# EAGLE design Pure Keys aec-pcb2-inProgress (EAGLE 8.7.0)

## Sheet 1 of 7: ATMEGA328P
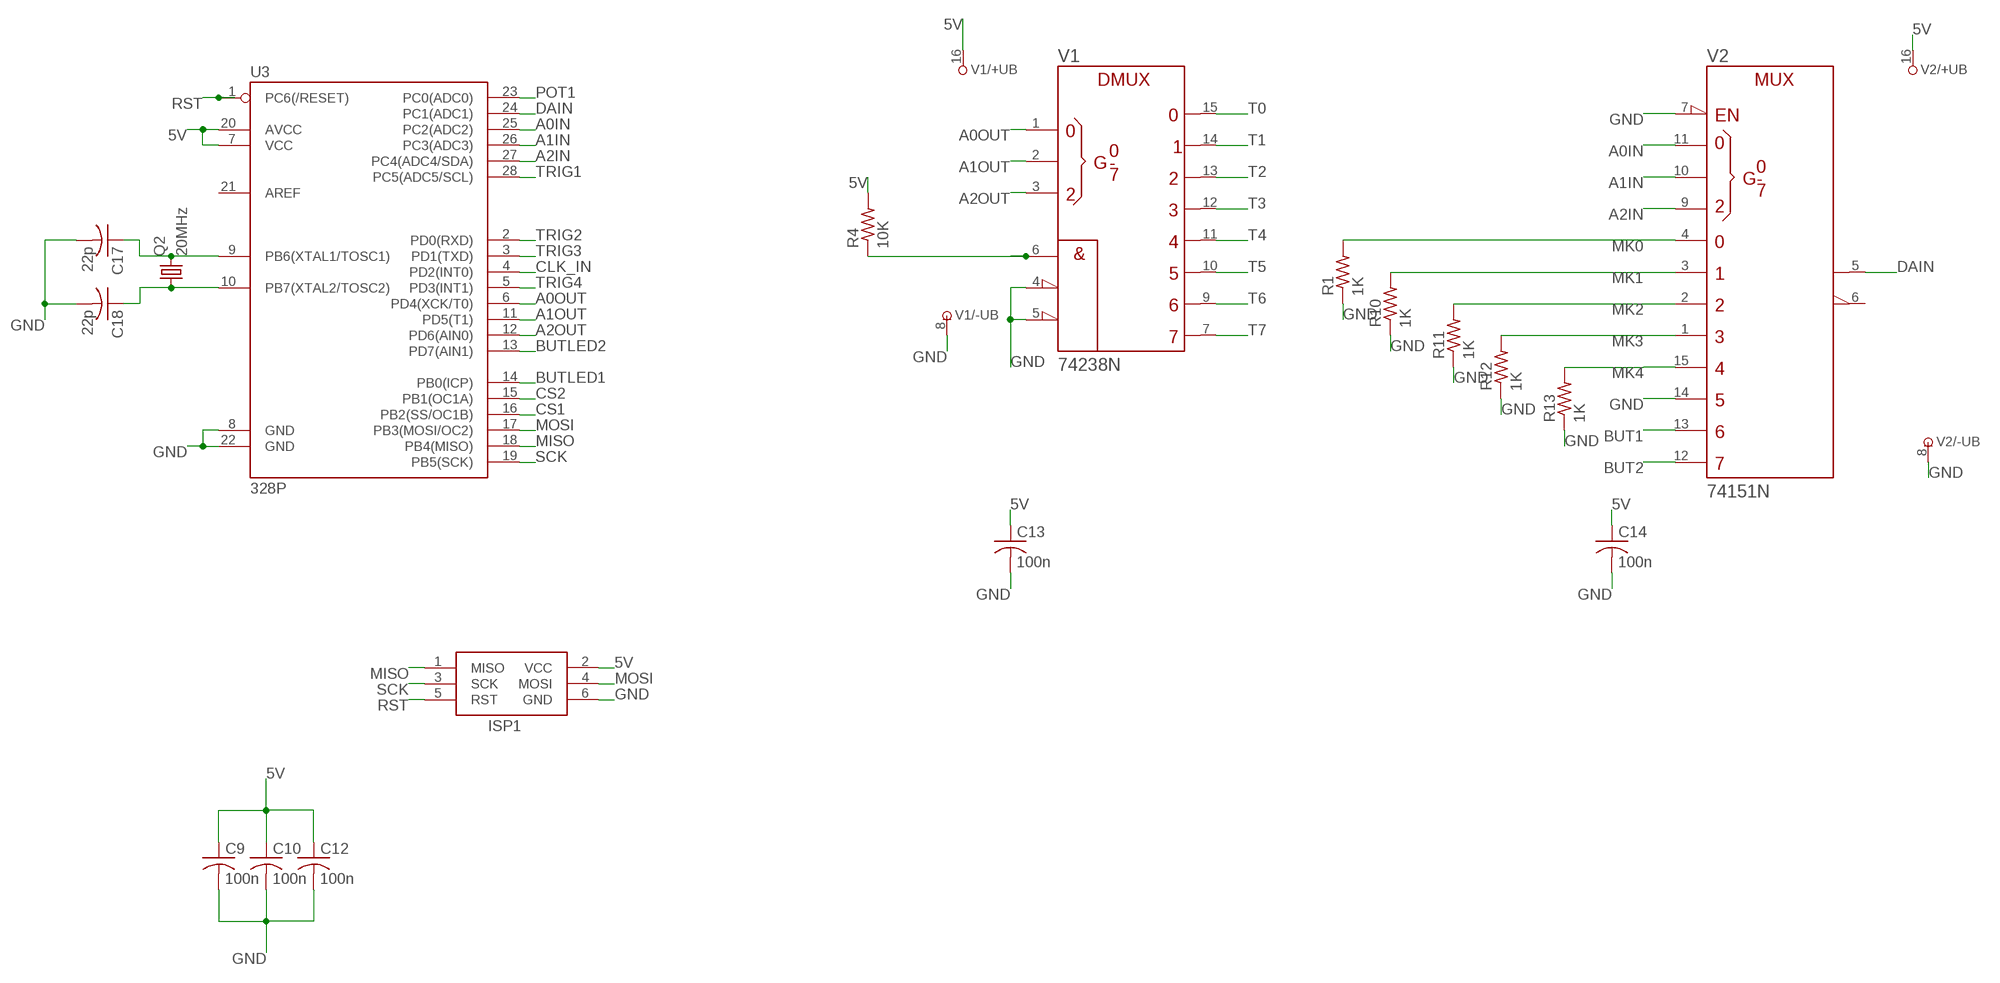
[diagram p0: schematic, sheet 1]

### Parts
C9  100n  C-USC0805K  [C0805K]
C10  100n  C-USC0805K  [C0805K]
C12  100n  C-USC0805K  [C0805K]
C13  100n  C-USC0805K  [C0805K]
C14  100n  C-USC0805K  [C0805K]
C17  22p  C-USC0805K  [C0805K]
C18  22p  C-USC0805K  [C0805K]
ISP1  AVRISP-6  [AVRISP]
Q2  20MHz  CRYSTALHC49UP  [HC49UP]
R1  1K  R-US_R0805  [R0805]
R4  10K  R-US_R0805  [R0805]
R10  1K  R-US_R0805  [R0805]
R11  1K  R-US_R0805  [R0805]
R12  1K  R-US_R0805  [R0805]
R13  1K  R-US_R0805  [R0805]
U3  328P  ATMEGA328P_PDIP  [DIP28]
V1  74238N  [DIL16]
V2  74151N  [DIL16]

### Nets
5V [Power]: C9.1 C10.1 C12.1 C13.1 C14.1 ISP1.2(VCC) R4.2 U3.7(VCC) U3.20(AVCC) V1.16(+UB) V2.16(+UB) ; also sheet 2,4,5,6,7
A0IN: U3.25(PC2(ADC2)) V2.11(A)
A0OUT: U3.6(PD4(XCK/T0)) V1.1(A)
A1IN: U3.26(PC3(ADC3)) V2.10(B)
A1OUT: U3.11(PD5(T1)) V1.2(B)
A2IN: U3.27(PC4(ADC4/SDA)) V2.9(C)
A2OUT: U3.12(PD6(AIN0)) V1.3(C)
BUT1: V2.13(D6) ; also sheet 6
BUT2: V2.12(D7) ; also sheet 6
BUTLED1: U3.14(PB0(ICP)) ; also sheet 6
BUTLED2: U3.13(PD7(AIN1)) ; also sheet 6
CLK_IN: U3.4(PD2(INT0)) ; also sheet 7
CS1: U3.16(PB2(SS/OC1B)) ; also sheet 5
CS2: U3.15(PB1(OC1A)) ; also sheet 5
DAIN: U3.24(PC1(ADC1)) V2.5(Y)
ENOUT: R4.1 V1.6(G1)
GND [Power]: C9.2 C10.2 C12.2 C13.2 C14.2 C17.2 C18.2 ISP1.6(GND) R1.1 R10.1 R11.1 R12.1 R13.1 U3.8(GND) U3.22(GND) V1.4(!G2A) V1.5(!G2B) V1.8(-UB) V2.7(!G) V2.8(-UB) V2.14(D5) ; also sheet 2,3,4,5,6,7
MISO: ISP1.1(MISO) U3.18(PB4(MISO))
MK0: R1.2 V2.4(D0) ; also sheet 3
MK1: R10.2 V2.3(D1) ; also sheet 3
MK2: R11.2 V2.2(D2) ; also sheet 3
MK3: R12.2 V2.1(D3) ; also sheet 3
MK4: R13.2 V2.15(D4) ; also sheet 3
MOSI: ISP1.4(MOSI) U3.17(PB3(MOSI/OC2)) ; also sheet 5
N$10: C17.1 Q2.2 U3.9(PB6(XTAL1/TOSC1))
N$11: C18.1 Q2.1 U3.10(PB7(XTAL2/TOSC2))
POT1: U3.23(PC0(ADC0)) ; also sheet 6
RST: ISP1.5(RST) U3.1(PC6(/RESET))
SCK: ISP1.3(SCK) U3.19(PB5(SCK)) ; also sheet 5
T0: V1.15(Y0) ; also sheet 3
T1: V1.14(Y1) ; also sheet 3
T2: V1.13(Y2) ; also sheet 3
T3: V1.12(Y3) ; also sheet 3
T4: V1.11(Y4) ; also sheet 3
T5: V1.10(Y5) ; also sheet 3
T6: V1.9(Y6) ; also sheet 3
T7: V1.7(Y7) ; also sheet 3
TRIG1: U3.28(PC5(ADC5/SCL)) ; also sheet 4
TRIG2: U3.2(PD0(RXD)) ; also sheet 4
TRIG3: U3.3(PD1(TXD)) ; also sheet 4
TRIG4: U3.5(PD3(INT1)) ; also sheet 4
Unconnected: U3.21(AREF) V2.6(W)

## Sheet 2 of 7: Power
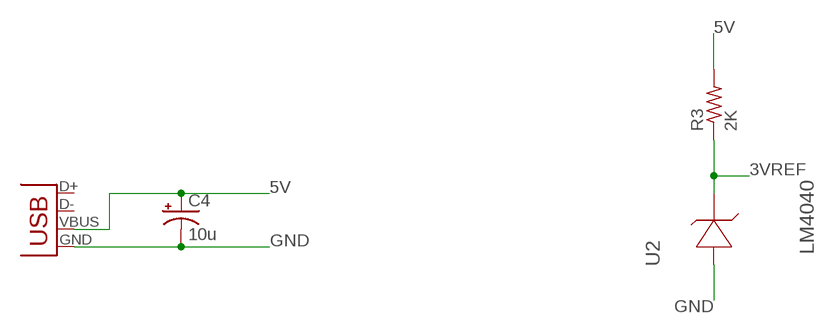
[diagram p1: schematic, sheet 2]

### Parts
C4  10u  CPOL-US153CLV-0505  [153CLV-0505]
JP2  USB-B  USBPTH  [USB-B-PTH]
R3  2K  R-US_R0805  [R0805]
U2  LM4040  LM4040A30IDBZT  [SOT95P237X112-3N]

### Nets
3VREF: R3.1 U2.1(CATHODE) ; also sheet 5
5V [Power]: C4.+ JP2.VBUS R3.2 ; also sheet 1,4,5,6,7
GND [Power]: C4.- JP2.GND U2.2(ANODE) ; also sheet 1,3,4,5,6,7
Unconnected: JP2.D+ JP2.D- U2.3(NC)

## Sheet 3 of 7: Keyboard Connector
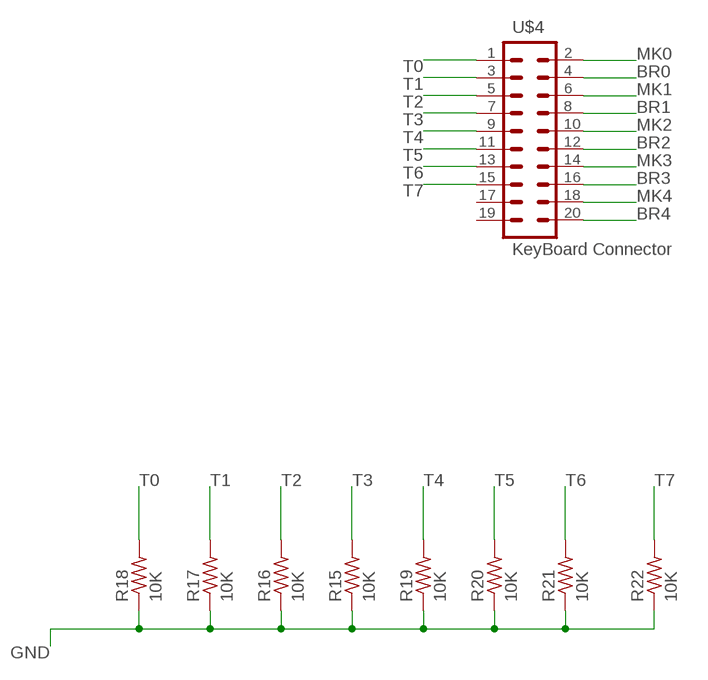
[diagram p2: schematic, sheet 3]

### Parts
R15  10K  R-US_R0805  [R0805]
R16  10K  R-US_R0805  [R0805]
R17  10K  R-US_R0805  [R0805]
R18  10K  R-US_R0805  [R0805]
R19  10K  R-US_R0805  [R0805]
R20  10K  R-US_R0805  [R0805]
R21  10K  R-US_R0805  [R0805]
R22  10K  R-US_R0805  [R0805]
U$4  KeyBoard Connector  M10X22X10_LOCK  [2X10_LOCK]

### Nets
BR0: U$4.4
BR1: U$4.8
BR2: U$4.12
BR3: U$4.16
BR4: U$4.20
GND [Power]: R15.1 R16.1 R17.1 R18.1 R19.1 R20.1 R21.1 R22.1 ; also sheet 1,2,4,5,6,7
MK0: U$4.2 ; also sheet 1
MK1: U$4.6 ; also sheet 1
MK2: U$4.10 ; also sheet 1
MK3: U$4.14 ; also sheet 1
MK4: U$4.18 ; also sheet 1
T0: R18.2 U$4.1 ; also sheet 1
T1: R17.2 U$4.3 ; also sheet 1
T2: R16.2 U$4.5 ; also sheet 1
T3: R15.2 U$4.7 ; also sheet 1
T4: R19.2 U$4.9 ; also sheet 1
T5: R20.2 U$4.11 ; also sheet 1
T6: R21.2 U$4.13 ; also sheet 1
T7: R22.2 U$4.15 ; also sheet 1
Unconnected: U$4.17 U$4.19

## Sheet 4 of 7: Triggers
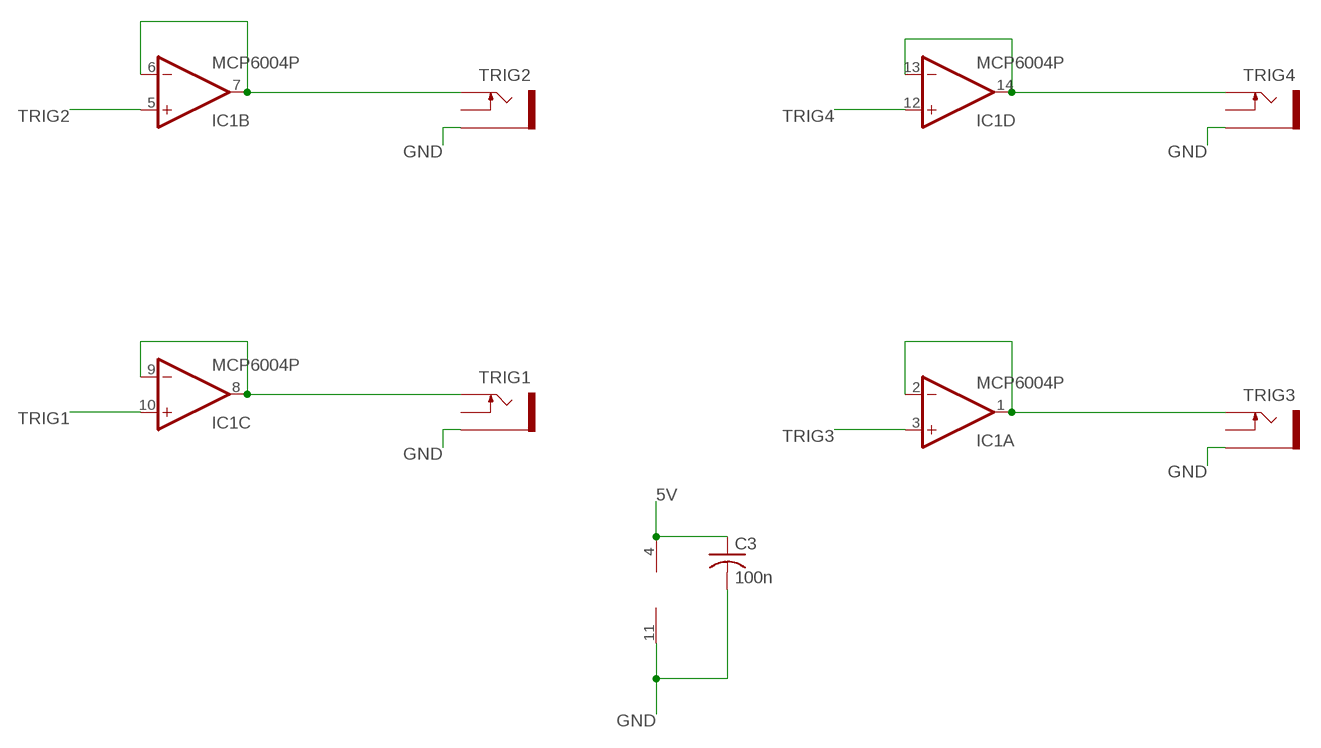
[diagram p3: schematic, sheet 4]

### Parts
C3  100n  C-USC0805K  [C0805K]
IC1  MCP6004P  [DIL14]
TRIG1  PJ302M  [PJ302M]
TRIG2  PJ302M  [PJ302M]
TRIG3  PJ302M  [PJ302M]
TRIG4  PJ302M  [PJ302M]

### Nets
5V [Power]: C3.1 IC1.4(P:V+) ; also sheet 1,2,5,6,7
GND [Power]: C3.2 IC1.11(P:V-) TRIG1.GND(SLEEVE) TRIG2.GND(SLEEVE) TRIG3.GND(SLEEVE) TRIG4.GND(SLEEVE) ; also sheet 1,2,3,5,6,7
N$3: IC1.6(B:-IN) IC1.7(B:OUT) TRIG2.TIP
N$4: IC1.8(C:OUT) IC1.9(C:-IN) TRIG1.TIP
N$5: IC1.13(D:-IN) IC1.14(D:OUT) TRIG4.TIP
N$6: IC1.1(A:OUT) IC1.2(A:-IN) TRIG3.TIP
TRIG1: IC1.10(C:+IN) ; also sheet 1
TRIG2: IC1.5(B:+IN) ; also sheet 1
TRIG3: IC1.3(A:+IN) ; also sheet 1
TRIG4: IC1.12(D:+IN) ; also sheet 1
Unconnected: TRIG1.SW(SWITCH) TRIG2.SW(SWITCH) TRIG3.SW(SWITCH) TRIG4.SW(SWITCH)

## Sheet 5 of 7: CV Out
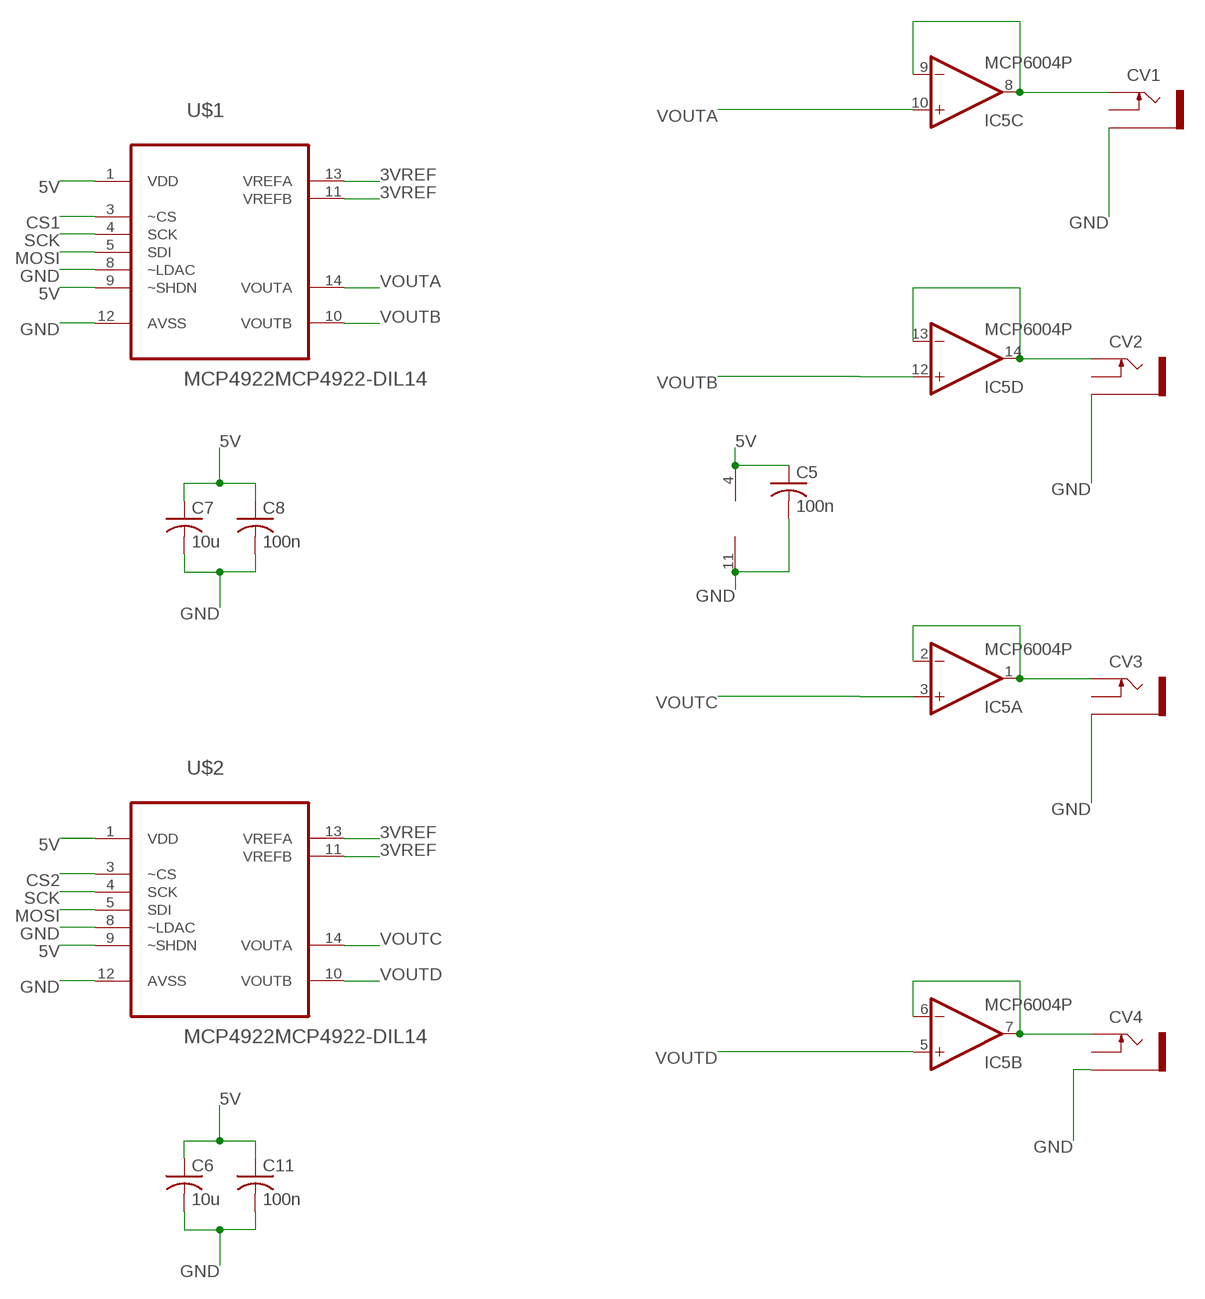
[diagram p4: schematic, sheet 5]

### Parts
C5  100n  C-USC0805K  [C0805K]
C6  10u  C-USC0805K  [C0805K]
C7  10u  C-USC0805K  [C0805K]
C8  100n  C-USC0805K  [C0805K]
C11  100n  C-USC0805K  [C0805K]
CV1  PJ302M  [PJ302M]
CV2  PJ302M  [PJ302M]
CV3  PJ302M  [PJ302M]
CV4  PJ302M  [PJ302M]
IC5  MCP6004P  [DIL14]
U$1  MCP4922MCP4922-DIL14  [DIL14]
U$2  MCP4922MCP4922-DIL14  [DIL14]

### Nets
3VREF: U$1.11(VREFB) U$1.13(VREFA) U$2.11(VREFB) U$2.13(VREFA) ; also sheet 2
5V [Power]: C5.1 C6.1 C7.1 C8.1 C11.1 IC5.4(P:V+) U$1.1(VDD) U$1.9(~SHDN) U$2.1(VDD) U$2.9(~SHDN) ; also sheet 1,2,4,6,7
CS1: U$1.3(~CS) ; also sheet 1
CS2: U$2.3(~CS) ; also sheet 1
GND [Power]: C5.2 C6.2 C7.2 C8.2 C11.2 CV1.GND(SLEEVE) CV2.GND(SLEEVE) CV3.GND(SLEEVE) CV4.GND(SLEEVE) IC5.11(P:V-) U$1.8(~LDAC) U$1.12(AVSS) U$2.8(~LDAC) U$2.12(AVSS) ; also sheet 1,2,3,4,6,7
MOSI: U$1.5(SDI) U$2.5(SDI) ; also sheet 1
N$7: CV1.TIP IC5.8(C:OUT) IC5.9(C:-IN)
N$25: CV4.TIP IC5.6(B:-IN) IC5.7(B:OUT)
N$31: CV3.TIP IC5.1(A:OUT) IC5.2(A:-IN)
N$36: CV2.TIP IC5.13(D:-IN) IC5.14(D:OUT)
SCK: U$1.4(SCK) U$2.4(SCK) ; also sheet 1
VOUTA: IC5.10(C:+IN) U$1.14(VOUTA)
VOUTB: IC5.12(D:+IN) U$1.10(VOUTB)
VOUTC: IC5.3(A:+IN) U$2.14(VOUTA)
VOUTD: IC5.5(B:+IN) U$2.10(VOUTB)
Unconnected: CV1.SW(SWITCH) CV2.SW(SWITCH) CV3.SW(SWITCH) CV4.SW(SWITCH)

## Sheet 6 of 7: Pots and Buttons
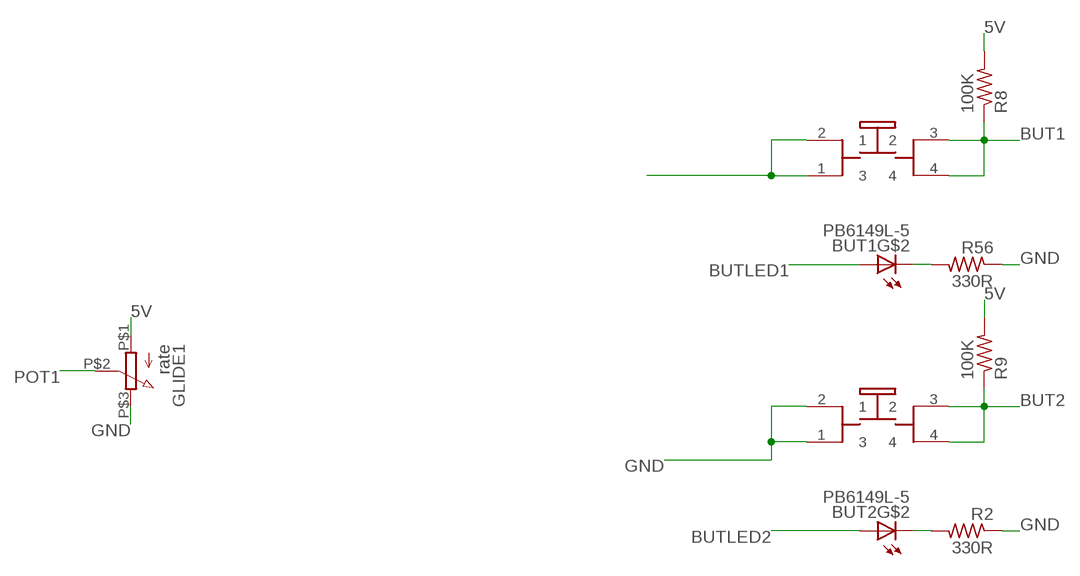
[diagram p5: schematic, sheet 6]

### Parts
BUT1  PB6149L-5  [PB6149L]
BUT2  PB6149L-5  [PB6149L]
GLIDE1  rate  9MMPOT  [POT]
R2  330R  R-US_R0805  [R0805]
R8  100K  R-US_R0805  [R0805]
R9  100K  R-US_R0805  [R0805]
R56  330R  R-US_R0805  [R0805]

### Nets
5V [Power]: GLIDE1.P$1 R8.2 R9.2 ; also sheet 1,2,4,5,7
BUT1: BUT1.3 BUT1.4 R8.1 ; also sheet 1
BUT2: BUT2.3 BUT2.4 R9.1 ; also sheet 1
BUTLED1: BUT1.A ; also sheet 1
BUTLED2: BUT2.A ; also sheet 1
GND [Power]: BUT1.1 BUT1.2 BUT2.1 BUT2.2 GLIDE1.P$3 R2.1 R56.1 ; also sheet 1,2,3,4,5,7
N$8: BUT2.K(C) R2.2
N$65: BUT1.K(C) R56.2
POT1: GLIDE1.P$2 ; also sheet 1

## Sheet 7 of 7: Clock
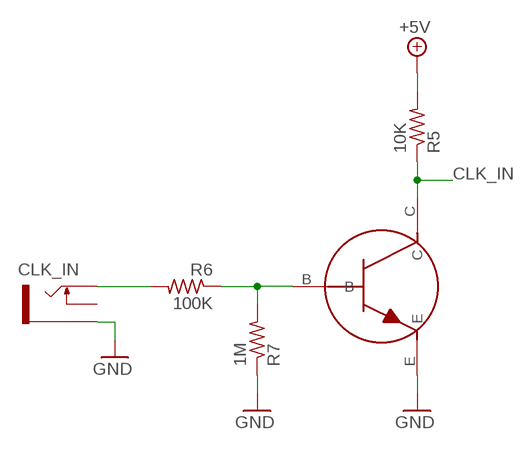
[diagram p6: schematic, sheet 7]

### Parts
CLK_IN  PJ302M  [PJ302M]
R5  10K  R-US_R0805  [R0805]
R6  100K  R-US_R0805  [R0805]
R7  1M  R-US_R0805  [R0805]
T1  2N3904  TRANSISTOR_MMBT3904  [TRANSISTOR_SINGLE_N-TYPE]

### Nets
5V [Power]: R5.2 ; supply symbol labelled +5V ; also sheet 1,2,4,5,6
CLK_IN: R5.1 T1.C ; also sheet 1
GND [Power]: CLK_IN.GND(SLEEVE) R7.1 T1.E ; also sheet 1,2,3,4,5,6
N$17: R6.1 R7.2 T1.B
N$26: CLK_IN.TIP R6.2
Unconnected: CLK_IN.SW(SWITCH)

## Library data of the parts
BUT1 BUT2 = INSTRUO:PB6149L-5
C3 C5-C14 C17 C18 = rcl:C-US: CAPACITOR, American symbol
C4 = rcl:CPOL-US: POLARIZED CAPACITOR, American symbol
CLK_IN CV1-CV4 TRIG1-TRIG4 = GMSN:PJ302M: PJ302M horizontal / right angled mount 3.5 mm jack socket
GLIDE1 = GMSN:9MMPOT
IC1 IC5 = GMSN-R2Project:MCP6004: OP AMP
ISP1 = adafruit:AVRISP: AVR ISP HEADER Standard 6 pin header for AVR programming
JP2 = SparkFun-Connectors:USB: USB Connectors USB-B-PTH is fully proven SKU : PRT-00139/CONN-08278 USB-miniB is fully proven SKU : PRT-00587 USB-A-PCB is untested. USB-A-H is throughly reviewed, but untested. Spark Fun Electronics SKU : PRT-00437 USB-B-SMT is throughly reviewed, but untested. Needs silkscreen touching up. USB-A-S has not been used/tested USB-MB-H has not been used/tested USB-MICROB has been used. CONN-09505; PROD_ID: CONN-08278
Q2 = adafruit:CRYSTAL: CRYSTAL; OC_FARNELL: unknown; OC_NEWARK: unknown
R1-R13 R15-R22 R56 = rcl:R-US_: RESISTOR, American symbol
T1 = INSTRUO:TRANSISTOR_MMBT3904
U2 = GMSN-R2Project:LM4040A30IDBZT: PRECISION MICROPOWER SHUNT VOLTAGE REFERENCE; MPN: LM4040A30IDBZT; OC_FARNELL: 1755108; OC_NEWARK: 58K5870; PACKAGE: 3-SOT-23; SUPPLIER: TEXAS INSTRUMENTS
U3 = SparkFun-IC-Microcontroller:ATMEGA328P_PDIP: Atmel 328P Through hole ATMEGA328P uC used in the Arduino 32kb flash, 1k EEPROM, 2k SRAM Datasheet <http://www.sparkfun.com/datasheets/Components/SMD/ATMega328.pdf> SparkFun Products Storefront component: AVR 28 Pin 20MHz 32K 6A/D - ATMega328P <https://www.sparkfun.com/products/9061> (COM-09061) SparkFun Simon Says - Through-Hole Soldering Kit <https://www.sparkfun.com/products/10547> (KIT-10547) SparkFun Learn to Solder - Simon Says <https://www.sparkfun.com/products/13708> (KIT-13708) SparkFun BigTime Watch Kit <https://www.sparkfun.com/products/11734> (KIT-11734) SparkFun ClockIt <https://www.sparkfun.com/products/10930> (KIT-10930) SparkFun Serial Enabled LCD Kit <https://www.sparkfun.com/products/10097> (LCD-10097) SparkFun Simon Tilts - Through Hole Soldering Kit <https://www.sparkfun.com/products/12634> (KIT-12634) SparkFun Frequency Counter Kit <https://www.sparkfun.com/products/10140> (KIT-10140) FabFM Radio Kit <https://www.sparkfun.com/products/11043> (KIT-11043) SparkFun Binary Blaster Kit <https://www.sparkfun.com/products/12037> (KIT-12037) SparkFun Metro-Gnome <https://www.sparkfun.com/products/9236> (KIT-09236) ATmega328 with Arduino Optiboot (Uno) <https://www.sparkfun.com/products/10524> (DEV-10524); PROD_ID: IC-09136
U$1 U$2 = GMSN-R2Project:MCP4922
U$4 = SparkFun-Connectors:M10X2: This was SPECIALLY designed to be used with our Graphic LCD Backpack. Be sure you want to use this! It is not only staggered on each line of header holes, but IT IS ALSO offset of the center point of the top and bottom lines by 5 mil. This causes the headers to lock into place on the "standard" footprint on the LCD screen. The extra squares on the tdocu layer are there simply to reference other pins (if you were to actually populate a longer header than ten long - this is what we do with the backpacks).
V1 = 74ttl-din:74*238: 1 of 8 noninverting DECODER/DEMULTIPLEXER
V2 = 74ttl-din:74*151: Data SELECTOR/MULTIPLEXER

## Net classes
1 Power: width 0.8 mm

## Board
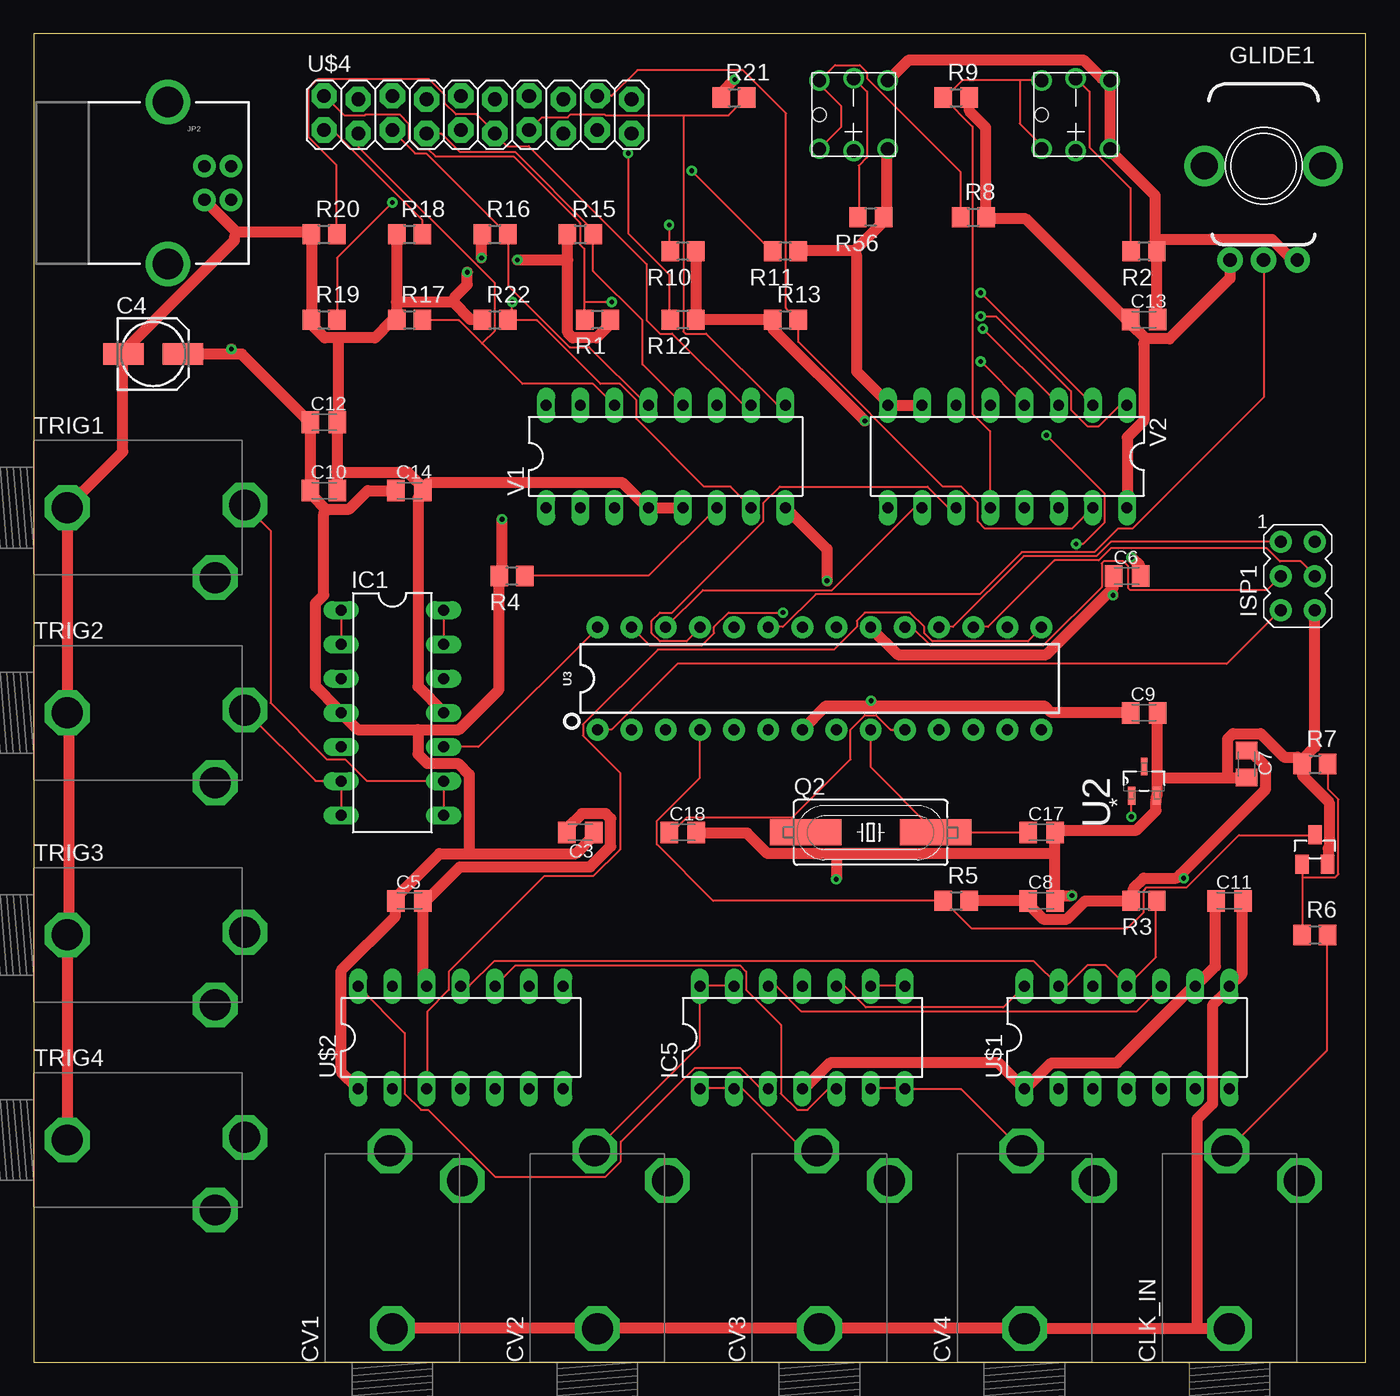
[diagram p7: board, top side]
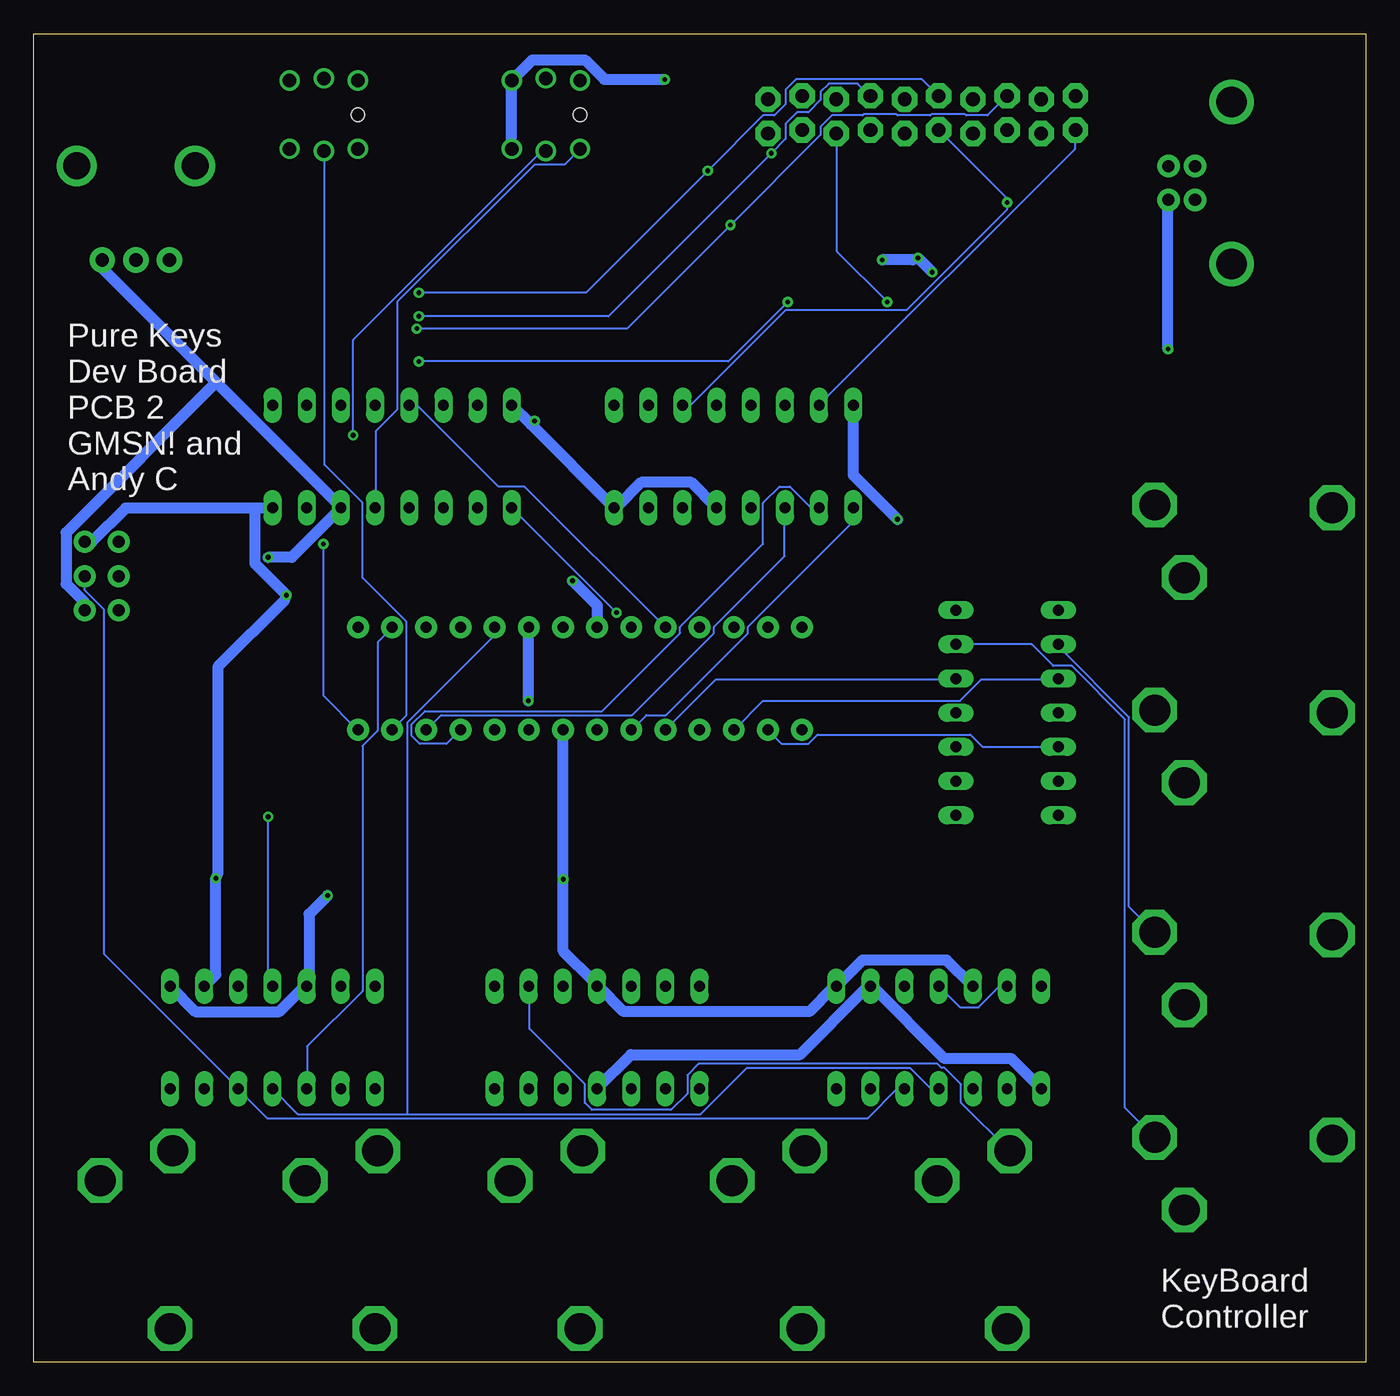
[diagram p8: board, bottom side, seen from below]

Size 99.04 x 98.73 mm. Coordinates in mm from the lower left corner, seen from the top.
Outline: 0,0 99.04,0 99.04,98.73 0,98.73 0,0
Copper layers (1*16): Top 0.035mm / dielectric 1.5mm / Bottom 0.035mm
Design rules "default": minimum track width 6mil, minimum drill 0.35mm, track to track 6mil, track to pad 6mil, pad to pad 6mil, via to via 6mil, smd to smd 6mil, copper to edge 40mil, drill to drill 6mil, minimum pad ring 10mil, minimum via ring 8mil, stop-mask expansion 4mil, vias tented up to drill 0mil, thermal gap 10mil

### Footprints (pad centres in the part's own frame; a part is rotated, then mirrored left to right if it is on the bottom)
PB6149L = drill 1: 1 2.54,-2.54; 2 2.54,2.54; 3 -2.54,-2.54; 4 -2.54,2.54; A 0,-2.7; K 0,2.7 | hole 1: -2.54,0
C0805K = smd 1.3 x 1.6: 1 -1,0; 2 1,0
153CLV-0505 = smd 3 x 1.6: + 2.2,0; - -2.2,0
PJ302M = drill 2.3 pad 3.3 octagon: GND 2.5,0; SW 13.5,-5.2; TIP 15.7,0.2
POT = drill 1 pad 1.88: P$1 -2.5,-7; P$2 0,-7; P$3 2.5,-7 | drill 2 pad 2.68: P$4 -4.4,0; P$5 4.4,0
DIL14 = drill 0.813 long: 1 -7.62,-3.81; 2 -5.08,-3.81; 3 -2.54,-3.81; 4 0,-3.81; 5 2.54,-3.81; 6 5.08,-3.81; 7 7.62,-3.81; 8 7.62,3.81; 9 5.08,3.81; 10 2.54,3.81; 11 0,3.81; 12 -2.54,3.81; 13 -5.08,3.81; 14 -7.62,3.81
AVRISP = drill 0.9 pad 1.626: 1 -1.27,2.54; 2 1.27,2.54; 3 -1.27,0; 4 1.27,0; 5 -1.27,-2.54; 6 1.27,-2.54
USB-B-PTH = drill 0.914 pad 1.676: D+ 0,1.25; D- 1.981,1.25; GND 0,-1.25; VBUS 1.981,-1.25 | drill 2.286: S1 -2.718,-6.02; S2 -2.718,6.02
HC49UP = smd 5.334 x 1.93: 1 -4.826,0; 2 4.826,0
R0805 = smd 1.3 x 1.5: 1 -0.95,0; 2 0.95,0
TRANSISTOR_SINGLE_N-TYPE = smd 1 x 1.4: B -0.95,-1.1; C 0,1.1; E 0.95,-1.1
SOT95P237X112-3N = smd 1.321 x 0.559: 1 -1.092,0.94; 2 -1.092,-0.94 | smd 1.321 x 0.508: 3 1.092,0
DIP28 = drill 0.813 pad 1.626: 1 -16.51,-3.81; 2 -13.97,-3.81; 3 -11.43,-3.81; 4 -8.89,-3.81; 5 -6.35,-3.81; 6 -3.81,-3.81; 7 -1.27,-3.81; 8 1.27,-3.81; 9 3.81,-3.81; 10 6.35,-3.81; 11 8.89,-3.81; 12 11.43,-3.81; 13 13.97,-3.81; 14 16.51,-3.81; 15 16.51,3.81; 16 13.97,3.81; 17 11.43,3.81; 18 8.89,3.81; 19 6.35,3.81; 20 3.81,3.81; 21 1.27,3.81; 22 -1.27,3.81; 23 -3.81,3.81; 24 -6.35,3.81; 25 -8.89,3.81; 26 -11.43,3.81; 27 -13.97,3.81; 28 -16.51,3.81
2X10_LOCK = drill 1.016 pad 1.88 octagon: 1 -11.43,-1.143; 2 -11.43,1.397; 3 -8.89,-1.397; 4 -8.89,1.143; 5 -6.35,-1.143; 6 -6.35,1.397; 7 -3.81,-1.397; 8 -3.81,1.143; 9 -1.27,-1.143; 10 -1.27,1.397; 11 1.27,-1.397; 12 1.27,1.143; 13 3.81,-1.143; 14 3.81,1.397; 15 6.35,-1.397; 16 6.35,1.143; 17 8.89,-1.143; 18 8.89,1.397; 19 11.43,-1.397; 20 11.43,1.143
DIL16 = drill 0.813 long: 1 -8.89,-3.81; 2 -6.35,-3.81; 3 -3.81,-3.81; 4 -1.27,-3.81; 5 1.27,-3.81; 6 3.81,-3.81; 7 6.35,-3.81; 8 8.89,-3.81; 9 8.89,3.81; 10 6.35,3.81; 11 3.81,3.81; 12 1.27,3.81; 13 -1.27,3.81; 14 -3.81,3.81; 15 -6.35,3.81; 16 -8.89,3.81

### Placement (x,y rotation side)
BUT1  60.96,92.71 0 top
BUT2  77.47,92.71 0 top
C3  40.64,39.37 180 top
C4  8.89,74.93 0 top
C5  27.94,34.29 0 top
C6  81.28,58.42 0 top
C7  90.17,44.45 270 top
C8  74.93,34.29 0 top
C9  82.55,48.26 0 top
C10  21.59,64.77 0 top
C11  88.9,34.29 0 top
C12  21.59,69.85 0 top
C13  82.55,77.47 0 top
C14  27.94,64.77 0 top
C17  74.93,39.37 0 top
C18  48.26,39.37 0 top
CLK_IN  88.9,0 90 top
CV1  26.67,0 90 top
CV2  41.91,0 90 top
CV3  58.42,0 90 top
CV4  73.66,0 90 top
GLIDE1  91.44,88.9 0 top
IC1  26.67,48.26 270 top
IC5  57.15,24.13 0 top
ISP1  93.98,58.42 0 top
JP2  12.7,87.63 0 top
Q2  62.23,39.37 0 top
R1  41.91,77.47 180 top
R2  82.55,82.55 180 top
R3  82.55,34.29 180 top
R4  35.56,58.42 180 top
R5  68.58,34.29 0 top
R6  95.25,31.75 0 top
R7  95.25,44.45 0 top
R8  69.85,85.09 0 top
R9  68.58,93.98 0 top
R10  48.26,82.55 180 top
R11  55.88,82.55 180 top
R12  48.26,77.47 180 top
R13  55.88,77.47 0 top
R15  40.64,83.82 0 top
R16  34.29,83.82 0 top
R17  27.94,77.47 0 top
R18  27.94,83.82 0 top
R19  21.59,77.47 0 top
R20  21.59,83.82 0 top
R21  52.07,93.98 0 top
R22  34.29,77.47 0 top
R56  62.23,85.09 180 top
T1  95.25,38.1 0 top
TRIG1  0,63.5 0 top
TRIG2  0,48.26 0 top
TRIG3  0,31.75 0 top
TRIG4  0,16.51 0 top
U2  82.55,43.18 90 top
U3  58.42,50.8 0 top
U$1  81.28,24.13 0 top
U$2  31.75,24.13 0 top
U$4  33.02,92.71 0 top
V1  46.99,67.31 0 top
V2  72.39,67.31 180 top

### Tracks (layer width: path | path; a pad name or v marks a point on that pad's centre or on a via)
3VREF  (via drill 0.35)
  Top 0.152: v81.61,40.54 U2.1 | R3.1 83.44,34.29 83.44,30.1 U$1.11 81.23,27.96 79.7,29.49 78.33,29.49 76.81,27.96 76.2,27.96 | 76.2,27.96 74.37,29.79 34.21,29.79 32.38,27.96 31.77,27.96 U$2.11 | 76.2,27.96 U$1.13
  Bottom 0.152: U$2.11 30.18,26.36 28.8,26.36 27.28,27.89 26.67,27.89 U$2.13 | v81.61,40.54 81.61,28.27 U$1.11
5V  (via drill 0.35)
  Top 0.8: C14.1 24.84,64.77 23.47,63.4 21.72,63.4 | 21.72,63.4 20.73,64.39 C10.1 20.57,64.77 20.57,69.8 C12.1 20.27,70.1 15.47,74.91 14.71,74.91 | 14.71,74.91 11.12,74.91 C4.+ | v14.71,75.29 14.71,74.91 | U$2.1 24.08,20.34 22.86,21.57 22.86,29.11 26.9,33.15 26.9,34.29 C5.1 27.05,34.67 30.18,37.8 32.38,37.8 | 32.38,37.8 40.31,37.8 41.6,39.09 41.6,39.32 C3.1 | 28.57,47.02 24.08,47.02 22.86,48.23 IC1.4 22.63,48.54 20.95,50.22 20.95,56.39 21.57,57 21.57,63.02 21.72,63.4 | 28.57,47.02 31.62,47.02 34.59,49.99 34.59,58.37 R4.2 34.82,58.75 v34.82,62.64 | 32.38,37.8 32.38,43.66 31.55,44.5 29.26,44.5 28.57,45.19 28.57,47.02 | R5.2 C8.1 74.07,33.91 75.06,32.92 76.81,32.92 78.18,34.29 R3.2 81.76,34.67 81.76,35.2 82.53,35.97 84.96,35.97 85.23,36.23 | 85.23,36.23 91.59,42.6 91.59,44.27 90.45,45.41 90.22,45.41 C7.1 | C11.1 87.86,34.29 87.86,29.41 86.41,27.96 U$1.9 86.03,27.74 80.54,22.25 75.67,22.25 73.99,20.57 U$1.1 73.61,20.34 71.7,22.25 59.21,22.25 57.3,20.34 57.15,20.34 IC5.4 | v85.5,35.97 85.23,36.23 | 79.97,57.26 75.29,52.58 64.24,52.58 62.26,54.56 U3.20 | 79.97,57.26 80.24,57.53 80.24,58.37 C6.1 | 62.26,48.77 58.9,48.77 57.15,47.02 U3.7 | 62.26,48.77 75.13,48.77 75.59,48.31 81.53,48.31 C9.1 | v62.26,49.15 62.26,48.77 | R9.2 69.57,93.95 69.57,92.96 70.79,91.75 70.79,85.11 R8.2 71.17,84.96 73.76,84.96 81.15,77.57 C13.1 81.61,77.42 81.61,77.11 82.68,76.05 | 82.68,76.05 84.43,76.05 88.92,80.54 88.92,81.84 GLIDE1.P$1 | V2.16 81.31,63.55 81.31,68.73 82.53,69.95 82.53,75.67 82.68,76.05 | v80.24,57 79.97,57.26
  Bottom 0.8: v14.71,75.29 14.71,86.33 JP2.VBUS | U$2.1 26.36,22.55 31.32,22.55 36.65,27.89 36.8,27.89 U$2.9 37.19,27.74 42.06,22.86 54.63,22.86 57.15,20.34 IC5.4 | V1.16 38.1,65.91 v34.82,62.64 | U$1.9 85.5,28.8 v85.5,35.97 85.34,36.35 85.34,51.66 80.39,56.62 v80.24,57 82.6,59.36 82.6,63.48 | v62.26,49.15 62.26,54.56 U3.20 | ISP1.2 94.72,60.96 92.2,63.48 82.6,63.48 | 82.6,63.48 81.31,63.48 V2.16
A0IN
  Top 0.152: V2.11 68.58,63.55 67.97,63.55 66.45,65.08 55.47,65.08 54.25,63.86 54.25,62.48 47.47,55.7 46.56,55.7 45.95,55.09 45.95,54.18 46.56,53.57 48.54,53.57 49.53,54.56 U3.25
A0OUT
  Bottom 0.152: V1.1 38.1,62.48 45.95,54.63 45.95,54.18 52.05,48.08 53.49,48.08 54.56,47.02 U3.6
A1IN
  Top 0.152: U3.26 49.76,57.38 59.36,57.38 65.46,63.48 65.99,63.48 V2.10
A1OUT
  Bottom 0.152: U3.11 68.35,45.95 70.33,45.95 70.94,46.56 70.94,47.4 69.95,48.39 56.77,48.39 50.98,54.18 50.98,54.63 44.81,60.81 44.81,63.86 43.59,65.08 42.82,65.08 41.3,63.55 40.69,63.55 V1.2
A2IN  (via drill 0.35)
  Top 0.152: v55.7,55.7 51.66,55.7 50.6,54.63 50.6,54.18 49.68,53.26 45.8,53.26 U3.27
  Bottom 0.152: v55.7,55.7 V2.9
A2OUT
  Bottom 0.152: V1.3 43.2,63.48 43.2,59.89 48.46,54.63 48.46,54.18 54.56,48.08 68.73,48.08 69.8,47.02 U3.12
BUT1
  Top 0.152: R8.1 68.89,85.11 68.89,88.47 61.95,95.4 61.95,95.86 61.42,96.39 59.59,96.39 58.45,95.25 BUT1.4 58.52,95.25 58.52,94.87 60.05,93.34 60.05,91.82 58.45,90.22 BUT1.3
  Bottom 0.152: BUT1.3 59.59,89 61.8,89 72.01,78.79 72.01,70.79 73.61,69.19 73.61,63.55 V2.13
BUT2
  Top 0.152: BUT2.4 73.3,95.25 | 73.3,95.25 69.04,95.25 67.82,94.03 67.67,94.03 R9.1 67.67,93.95 69.8,91.82 69.8,70.48 71.09,69.19 71.09,63.55 V2.12 | 73.3,95.25 73.3,92.05 74.91,90.45 74.91,90.22 BUT2.3
BUTLED1  (via drill 0.35)
  Top 0.152: v75.29,68.89 79.63,64.54 79.63,62.41 78.03,60.81 v77.5,60.81
  Bottom 0.152: v75.29,68.89 75.29,75.97 61.27,89.99 60.96,89.99 BUT1.A | v77.5,60.81 77.5,49.53 74.98,47.02 U3.14
BUTLED2
  Bottom 0.152: BUT2.A 77.42,89.99 77.42,66.67 74.6,63.86 74.6,58.29 71.32,55.02 71.32,48.08 72.39,47.02 U3.13
CLK_IN
  Top 0.152: T1.C 95.25,39.17 89.61,39.17 85.72,35.28 82.75,35.28 82.53,35.05 82.53,33.45 81.31,32.23 69.72,32.23 67.67,34.29 R5.1 50.52,34.29 46.33,38.48 46.33,40.23 49.53,43.43 U3.4
CS1
  Bottom 0.152: U$1.3 78.72,20.34 78.72,23.47 74.6,27.58 74.6,45.8 73.46,46.94 73.46,53.49 72.39,54.56 U3.16
CS2
  Top 0.152: U$2.3 29.26,20.34 29.26,26.06 30.86,27.66 30.86,29.03 37.95,36.12 41.6,36.12 43.59,38.1 43.59,43.81 40.84,46.56 40.84,47.4 46.41,52.96 59.51,52.96 61.19,54.63 61.19,55.09 61.8,55.7 65.15,55.7 66.22,54.63 66.22,54.18 66.83,53.57 73.91,53.57 74.91,54.56 U3.15
DAIN
  Bottom 0.152: V2.5 71.09,71.09 70.48,71.09 64.47,65.08 62.56,65.08 52.12,54.63 U3.24
ENOUT
  Top 0.152: R4.1 36.58,58.45 45.72,58.45 50.75,63.48 V1.6
GND  (via drill 0.35)
  Top 0.8: CV1.GND 26.67,2.52 41.91,2.52 CV2.GND 42.29,2.52 58.06,2.52 CV3.GND 58.45,2.52 73.61,2.52 CV4.GND 74.07,2.52 86.49,2.52 | 86.49,2.52 88.85,2.52 CLK_IN.GND | U$2.12 28.96,28.19 28.96,34.29 C5.2 29.34,34.44 31.7,36.8 41.38,36.8 42.9,38.33 42.9,40.39 42.52,40.77 40.77,40.77 39.7,39.7 39.7,39.4 C3.2 | T1.E 96.24,37.03 96.24,38.18 96.32,38.25 96.32,41.6 94.34,43.59 94.34,44.42 R7.1 | ISP1.6 95.25,45.72 94.34,44.81 R7.1 | C11.2 89.84,34.29 89.84,28.88 U$1.8 88.7,27.58 87.63,26.52 87.63,19.2 86.49,18.06 86.49,2.52 | 83.52,43.43 83.52,48.23 C9.2 | 83.52,43.43 83.52,42.14 U2.2 83.44,41.68 83.44,41 81.99,39.55 76.28,39.55 C17.2 75.89,39.32 75.89,37.8 | 83.52,43.43 88.77,43.43 | 88.77,43.43 90.14,43.43 C7.2 | 75.89,37.8 75.89,34.29 C8.2 76.28,34.67 v77.19,34.67 | 75.89,37.8 59.66,37.8 | 59.66,37.8 54.56,37.8 53.03,39.32 49.3,39.32 C18.2 | 88.77,43.43 88.77,46.33 89.15,46.71 91.21,46.71 92.96,44.96 93.95,44.96 R7.1 | 59.66,37.8 v59.66,35.89 | v81.61,59.82 82.22,59.21 82.22,58.45 C6.2 | C13.2 83.52,77.5 83.52,82.53 R2.1 83.36,82.91 83.36,83.44 | 83.36,83.44 83.36,86.72 80.24,89.84 BUT2.1 BUT2.2 79.63,95.4 79.4,95.4 78.03,96.77 65.08,96.77 63.55,95.25 BUT1.2 | 83.36,83.44 92.05,83.44 93.57,81.92 93.88,81.92 GLIDE1.P$3 | 61.04,82.6 56.84,82.6 R11.1 | 61.04,82.6 63.17,84.73 63.17,85.04 R56.1 63.4,85.42 63.4,90.07 BUT1.1 | v52.12,95.33 51.13,94.34 51.13,94.03 R21.1 | R10.1 49.23,82.53 49.23,77.5 R12.1 49.61,77.5 54.86,77.5 R13.1 54.94,77.04 54.94,76.81 v61.8,69.95 | V2.7 65.99,71.09 63.55,71.09 V2.8 63.32,71.48 61.19,73.61 61.19,82.22 61.04,82.6 | V1.5 48.23,63.48 45.72,63.48 V1.4 45.41,63.7 43.74,65.38 29.41,65.38 29.26,65.23 C14.2
  Top 0.8: v58.98,58.06 58.98,60.43 55.93,63.48 V1.8 | 22.55,66.14 22.55,69.8 C12.2 22.63,70.26 22.63,76.12 | 22.55,66.14 22.55,64.77 C10.2 | 22.55,66.14 27.81,66.14 28.88,65.08 28.88,64.77 C14.2 | IC1.11 30.48,48.31 28.57,50.22 28.57,64.24 28.73,64.39 C14.2 | 15.09,83.97 12.72,86.33 JP2.GND | 15.09,83.97 20.27,83.97 R20.1 20.65,77.5 R19.1 20.8,77.11 20.8,76.96 21.64,76.12 22.63,76.12 | 39.7,81.92 39.7,76.5 40.08,76.12 41.83,76.12 42.82,77.11 42.82,77.42 R1.1 | 39.7,81.92 R15.1 | 26.98,78.79 26.98,83.82 R18.1 | 26.98,78.79 26.98,77.5 R17.1 26.59,77.34 25.38,76.12 22.63,76.12 | 31.17,78.79 32.46,77.5 33.3,77.5 R22.1 | 26.98,78.79 31.17,78.79 | v33.3,82.07 33.3,83.82 R16.1 | v32.23,81 32.23,80.09 31.32,79.17 31.17,78.79 | v35.97,81.92 39.7,81.92 | TRIG4.GND 2.52,16.54 2.52,31.7 TRIG3.GND 2.59,32.16 2.59,47.85 TRIG2.GND 2.52,48.31 2.52,63.09 TRIG1.GND 2.52,63.55 6.63,67.67 6.63,74.91 C4.- 6.86,75.29 14.94,83.36 14.94,83.59 15.09,83.97
  Bottom 0.8: U$2.12 29.26,27.96 31.17,29.87 37.41,29.87 39.32,27.96 U$2.8 39.7,27.74 41.38,26.06 55.17,26.06 57,27.89 57.15,27.89 IC5.11 57.38,28.27 59.66,30.56 v59.66,35.89 59.66,46.94 U3.8 | U$1.8 87.02,26.06 80.77,26.06 78.94,27.89 78.79,27.89 U$1.12 78.56,28.27 78.56,33.3 v77.19,34.67 | v81.61,59.82 79.86,59.82 76.2,63.48 V2.14 76.43,63.78 85.46,72.81 | 85.46,72.81 93.88,81.23 93.88,81.84 GLIDE1.P$3 | v52.12,95.33 56.62,95.33 58.06,96.77 61.95,96.77 63.48,95.25 BUT1.2 63.55,94.87 63.55,90.22 BUT1.1 | V1.5 50.14,65.38 53.87,65.38 55.7,63.55 55.85,63.55 V1.8 62.06,69.69 | U3.22 57.15,56.24 v58.98,58.06 | 62.06,69.69 V2.8 | v61.8,69.95 62.06,69.69 | v32.23,81 v33.3,82.07 33.68,81.92 v35.97,81.92 | ISP1.6 95.25,56.46 96.62,57.84 96.62,61.65 85.46,72.81
MISO
  Top 0.152: ISP1.1 80.09,60.96 79.02,59.89 73.61,59.89 68.35,54.63 67.36,54.63 U3.18
MK0  (via drill 0.35)
  Top 0.152: 40.92,78.79 40.92,82.75 40.62,83.06 40.62,84.66 35.66,89.61 29.87,89.61 29.34,90.14 28.65,90.14 27.89,90.91 27.89,92.05 27.2,92.73 24.69,92.73 24.61,92.66 23.09,92.66 21.64,94.11 U$4.2 | 40.92,78.79 40.92,77.5 R1.2 | v70.41,74.37 V2.4 | 40.92,78.79 v42.98,78.79
  Bottom 0.152: v70.41,74.37 47.4,74.37 v42.98,78.79
MK1  (via drill 0.35)
  Top 0.152: v47.24,84.51 47.24,82.6 R10.2 | v70.56,76.81 76.2,71.17 V2.3
  Bottom 0.152: U$4.6 28.12,92.66 29.72,92.66 29.79,92.73 32.31,92.73 32.38,92.66 34.82,92.66 34.9,92.73 37.34,92.73 37.41,92.66 39.7,92.66 40.54,91.82 40.54,91.21 v47.24,84.51 54.94,76.81 v70.56,76.81
MK2  (via drill 0.35)
  Top 0.152: v48.92,88.54 54.86,82.6 R11.2 | v70.41,79.48 78.72,71.17 V2.2
  Bottom 0.152: U$4.10 31.77,94.11 32.99,95.33 42.37,95.33 43.13,94.56 43.13,93.5 43.97,92.66 44.81,92.66 v48.92,88.54 57.99,79.48 v70.41,79.48
MK3  (via drill 0.35)
  Top 0.152: v44.2,89.84 44.2,83.9 47.24,80.85 47.24,77.5 R12.2 | v70.41,77.72 71.55,77.72 77.11,72.16 77.11,70.79 78.33,69.57 79.17,69.57 80.7,71.09 81.23,71.09 V2.1
  Bottom 0.152: U$4.14 36.88,94.11 37.8,95.02 39.93,95.02 40.54,94.41 40.54,93.8 41.45,92.89 42.29,92.89 43.13,92.05 43.13,90.91 v44.2,89.84 56.31,77.72 v70.41,77.72
MK4
  Top 0.152: V2.15 77.19,61.95 70.71,61.95 70.18,62.48 70.18,63.86 68.96,65.08 67.59,65.08 56.84,75.82 56.84,77.42 R13.2 56.77,77.5 55.93,78.33 55.93,92.81 52.73,96.01 44.88,96.01 42.98,94.11 U$4.18
MOSI
  Top 0.152: U3.17 69.88,54.63 70.94,54.63 75.89,59.59 79.17,59.59 80.09,60.5 91.67,60.5 92.66,59.51 94.18,59.51 95.25,58.45 ISP1.4
  Bottom 0.152: U$2.5 34.29,20.27 34.9,20.27 37.03,18.14 81.69,18.14 83.82,20.27 U$1.5 83.82,20.34 93.8,30.33 93.8,55.93 95.25,57.38 ISP1.4
N$3
  Top 0.152: IC1.7 IC1.6 22.86,43.2 20.95,43.2 15.77,48.39 TRIG2.TIP
N$4
  Top 0.152: IC1.8 IC1.9 30.48,43.2 24.77,43.2 23.16,44.81 21.79,44.81 17.6,49 17.6,61.8 15.77,63.63 TRIG1.TIP
N$5
  Top 0.152: IC1.14 IC1.13
  Bottom 0.152: IC1.13 24.84,53.34 23.24,51.74 21.87,51.74 17.91,47.78 17.91,18.9 15.77,16.76 TRIG4.TIP
N$6
  Top 0.152: IC1.1 IC1.2
  Bottom 0.152: IC1.2 22.86,53.19 17.6,47.93 17.6,33.83 15.77,32 TRIG3.TIP
N$7
  Top 0.152: IC5.9 62.26,27.96 64.77,27.96 IC5.8
  Bottom 0.152: IC5.9 62.18,27.89 62.18,24.77 58.06,20.65 58.06,19.28 57.53,18.75 51.66,18.75 50.44,19.96 50.44,21.34 49.61,22.17 31.85,22.17 31.55,21.87 31.32,21.87 30.1,20.65 30.1,19.28 26.52,15.7 CV1.TIP
N$8
  Top 0.152: R2.2 81.53,82.6 81.53,87.25 78.49,90.3 78.49,94.41 77.5,95.4 BUT2.K
N$10
  Top 0.152: 67.06,39.4 73.91,39.4 C17.1 | 67.06,39.4 62.26,44.2 62.26,46.94 U3.9 | 67.06,39.4 Q2.2
N$11
  Top 0.152: Q2.1 56.35,40.42 | 56.35,40.42 56.31,40.46 48.54,40.46 47.47,39.4 47.32,39.4 C18.1 | 56.35,40.42 60.73,44.81 60.73,47.02 61.8,48.08 62.64,48.08 63.7,47.02 64.77,47.02 U3.10
N$17
  Top 0.152: 94.34,36.04 94.34,31.77 R6.1 | 94.34,36.04 94.34,36.96 T1.B | 94.34,36.04 96.77,36.04 97,36.27 97,41.83 96.24,42.6 96.24,44.42 R7.2
N$25
  Top 0.152: IC5.6 62.26,20.34 64.77,20.34 IC5.7 64.77,20.27 68.96,20.27 73.46,15.77 CV4.TIP
N$26
  Top 0.152: R6.2 96.16,31.7 96.16,23.16 88.77,15.77 CLK_IN.TIP
N$31
  Top 0.152: IC5.1 49.53,20.34 52.05,20.34 IC5.2 52.12,20.27 52.73,20.27 57.23,15.77 58.22,15.77 CV3.TIP
N$36
  Top 0.152: IC5.13 52.05,27.96 49.53,27.96 IC5.14 49.53,23.55 41.76,15.77 CV2.TIP
N$65
  Top 0.152: R56.2 61.34,85.11 61.34,88.92 61.95,89.53 61.95,94.41 BUT1.K
POT1
  Top 0.152: GLIDE1.P$2 91.44,71.7 81.69,61.95 80.62,61.95 78.87,60.2 73.46,60.2 70.33,57.07 58.14,57.07 55.7,54.63 54.63,54.63 U3.23
RST
  Top 0.152: U3.1 41.91,47.02 42.98,47.02 47.85,51.89 88.7,51.89 92.66,55.85 ISP1.5
SCK
  Top 0.152: ISP1.3 91.67,57.38 81.53,57.38 81.38,57.53 81.38,59.13 81,59.51 79.55,59.51 79.4,59.36 79.4,57.61 75.06,53.26 66.67,53.26 65.38,54.56 64.77,54.56 U3.19
  Bottom 0.152: 71.25,18.44 79.4,18.44 U$1.4 | 71.25,18.44 49.45,18.44 46.02,21.87 33.91,21.87 32.38,20.34 31.77,20.34 U$2.4 | U3.19 64.77,54.03 71.25,47.55 71.25,18.44
T0
  Top 0.152: R18.2 28.88,84.89 22.25,91.52 21.64,91.52 U$4.1
  Bottom 0.152: V1.15 40.62,71.17 21.64,90.14 21.64,91.52 U$4.1
T1
  Top 0.152: 33.34,75.7 36.35,72.69 41.6,72.69 V1.14 | 33.34,75.7 31.62,77.42 28.96,77.42 R17.2 | 33.34,75.7 34.29,76.66 34.29,80.16 24.16,90.3 24.16,91.29 U$4.3
T2
  Top 0.152: U$4.5 26.67,91.52 28.35,89.84 29.18,89.84 35.2,83.82 R16.2 35.28,83.82 35.28,80.01 39.85,75.44 41.3,75.44 45.57,71.17 45.72,71.17 V1.13
T3
  Top 0.152: V1.12 48.23,71.17 45.26,74.14 45.26,77.42 41.6,81.08 41.6,83.82 R15.2 41.53,83.82 41.53,84.2 35.81,89.92 31.7,89.92 30.33,91.29 29.26,91.29 U$4.7
T4  (via drill 0.35)
  Top 0.152: v26.67,86.18 22.55,82.07 22.55,77.5 R19.2
  Bottom 0.152: U$4.9 26.67,86.49 v26.67,86.18 26.67,85.65 34.14,78.18 43.13,78.18 50.14,71.17 50.75,71.17 V1.11
T5
  Top 0.152: R20.2 22.48,83.82 22.48,89 20.42,91.06 20.42,94.64 21.11,95.33 29.41,95.33 30.56,94.18 30.56,93.57 31.39,92.73 32.92,92.73 34.29,91.36 U$4.11 34.29,91.29 35.2,90.37 36.8,90.37 45.57,81.61 45.57,77.42 46.56,76.43 47.47,76.43 52.73,71.17 53.34,71.17 V1.10
T6
  Top 0.152: 48.31,92.66 42.52,92.66 42.44,92.73 39.93,92.73 39.7,92.51 37.8,92.51 36.88,91.59 U$4.13 | 48.31,92.66 51.66,92.66 52.96,93.95 R21.2 | 48.31,92.66 48.31,76.58 48.46,76.43 49.99,76.43 55.24,71.17 55.85,71.17 V1.9
T7  (via drill 0.35)
  Top 0.152: 35.59,77.42 37.41,77.42 42.14,72.69 43.59,72.69 44.81,71.48 44.81,70.1 49.84,65.08 51.82,65.08 53.34,63.55 V1.7 | 35.59,77.42 35.28,77.42 R22.2 35.59,77.42 | 35.59,77.42 v35.59,78.79
  Bottom 0.152: v35.59,78.79 39.32,82.53 39.32,91.29 U$4.15
TRIG1
  Top 0.152: IC1.10 33.07,45.72 41.91,54.56 U3.28
TRIG2
  Bottom 0.152: IC1.5 28.5,45.72 29.41,46.63 40.77,46.63 41.45,45.95 43.43,45.95 44.42,46.94 U3.2
TRIG3
  Bottom 0.152: IC1.3 22.86,50.75 28.57,50.75 30.18,49.15 44.81,49.15 46.94,47.02 U3.3
TRIG4
  Bottom 0.152: U3.5 48.31,50.75 30.48,50.75 IC1.12
VOUTA
  Top 0.152: U$1.14 72.08,26.36 61.87,26.36 60.35,27.89 59.74,27.89 IC5.10
VOUTB
  Top 0.152: IC5.12 54.63,27.89 55.24,27.89 57.07,26.06 81.99,26.06 83.82,27.89 U$1.10
VOUTC
  Top 0.152: IC5.3 54.56,20.34 54.03,20.34 52.5,21.87 49.15,21.87 43.66,16.38 43.66,14.94 42.52,13.79 34.29,13.79 29.34,18.75 28.8,18.75 27.58,19.96 27.58,24.46 24.16,27.89 U$2.14
VOUTD
  Top 0.152: IC5.5 59.66,20.27 59.05,20.27 57.53,18.75 56.77,18.75 55.55,19.96 55.55,25.07 52.96,27.66 52.96,29.03 52.5,29.49 35.81,29.49 34.29,27.96 U$2.10

### Text on the board
bNames: Pure Keys / Dev Board / PCB 2 / GMSN! and / Andy C | KeyBoard / Controller